# Altium schematic sheet CubeSat.SchDoc: CubeSat
size A4; Date: 19/10/2025; DrawnBy: Maymoun Jabnouni; SheetNumber: 1; SheetTotal: 3; SPICEModelCacheKLYHITPL: <root> / <DocumentId>KLYHITPL</DocumentId> / <CacheFrame Number="0"> / <Model Name="cap" Kind="MDL"> / <Text>*Default semiconductor capacitor / .MODEL CAP C()</Text> / </Model> / </CacheFrame> / </root>
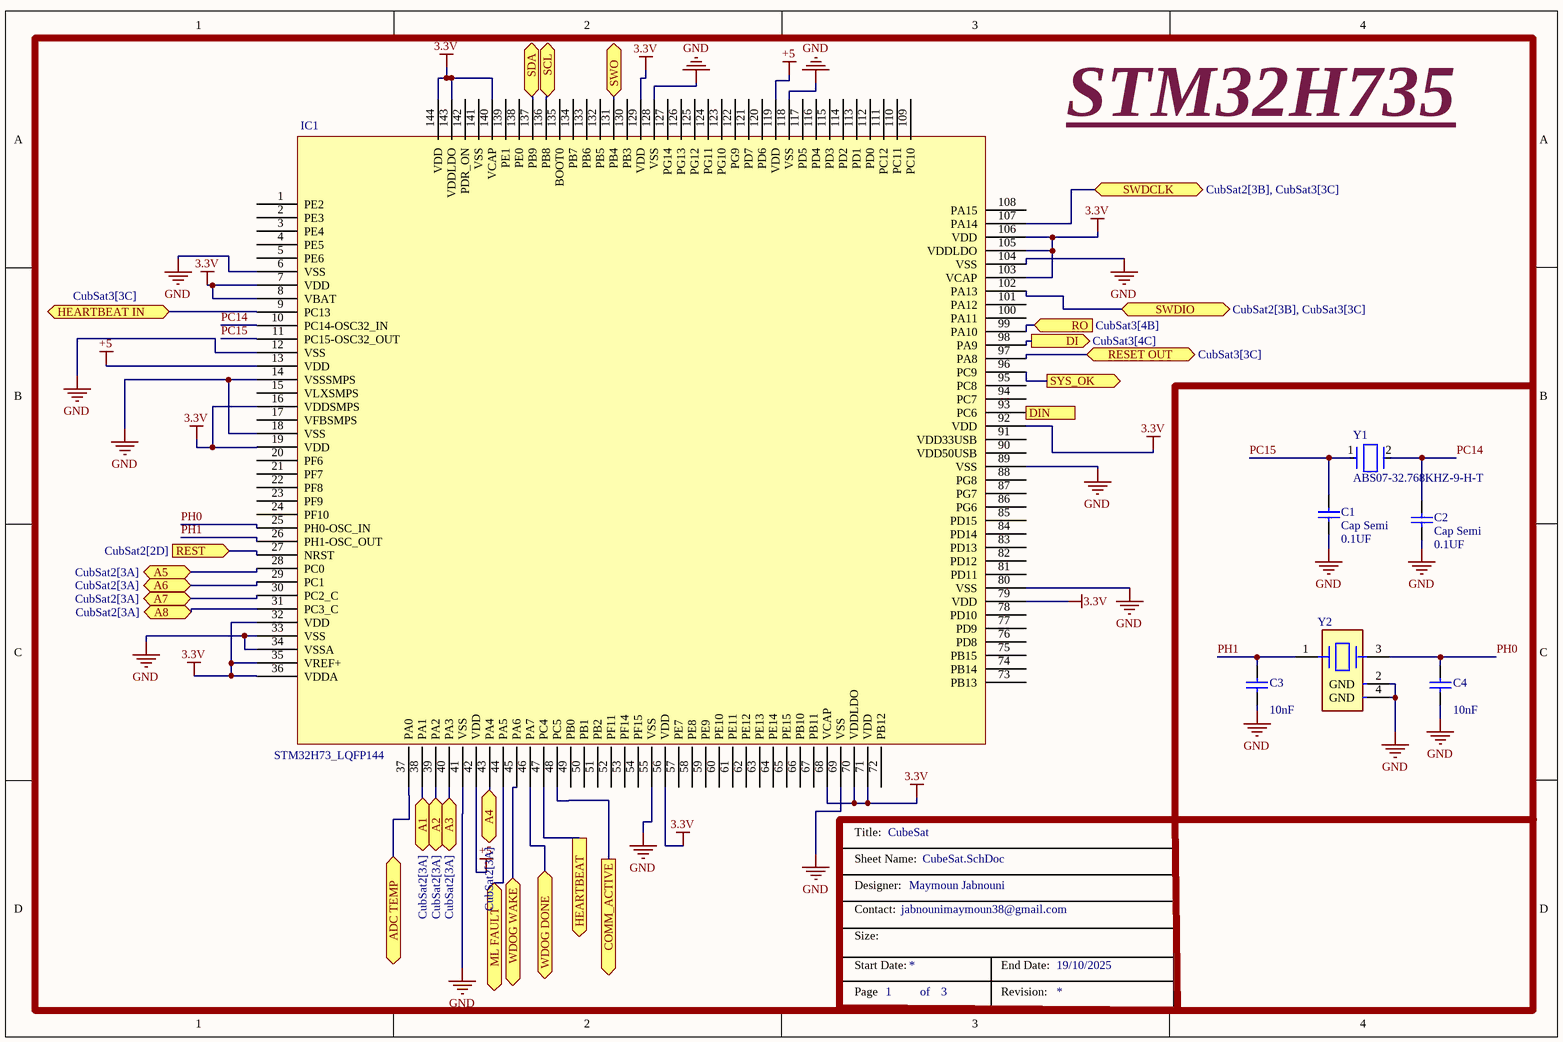
[diagram p0: CubeSat.SchDoc]

## Parts
C1  Cap Semi  value 0.1UF  [C1206]
C2  Cap Semi  value 0.1UF  [C1206]
C3  value 10nF  [C1206]  (hidden comment: Cap Semi)
C4  value 10nF  [C1206]  (hidden comment: Cap Semi)
IC1  STM32H73_LQFP144  [STM32H735LQFP144]
Y1  ABS07-32.768KHZ-9-H-T  [FP-ABS07-MFG]
Y2  ABM8W-19.0625MHZ-6-B1U-T3  [FP-ABM8W-MFG]  (value not drawn)

## Ports
A1 (bidir, see CubSat2[3A]), A2 (bidir, see CubSat2[3A]), A3 (bidir, see CubSat2[3A]), A4 (bidir, see CubSat2[3A]), A5 (bidir, see CubSat2[3A]), A6 (bidir, see CubSat2[3A]), A7 (bidir, see CubSat2[3A]), A8 (bidir, see CubSat2[3A]), ADC TEMP (bidir, see CubSat3[3C]), COMM_ACTIVE (out, see CubSat3[2A]), DI (out, see CubSat3[4C]), DIN (out, see CubSat3[1C]), HEARTBEAT (out, see CubSat3[1B]), HEARTBEAT IN (bidir, see CubSat3[3C]), ML FAULT (bidir, see CubSat3[3C]), RESET OUT (bidir, see CubSat3[3C]), REST (in, see CubSat2[2D]), RO (in, see CubSat3[4B]), SCL (bidir, see CubSat2[1B]), SDA (bidir, see CubSat2[1B]), SWDCLK (bidir, see CubSat2[3B], CubSat3[3C]), SWDIO (bidir, see CubSat2[3B], CubSat3[3C]), SWO (bidir, see CubSat2[3B]), SYS_OK (out, see CubSat3[1A]), WDOG DONE (bidir, see CubSat2[1D], CubSat3[3C]), WDOG WAKE (bidir, see CubSat2[2D], CubSat3[3C])

## Nets
3.3V: IC1.7(VDD) IC1.8(VBAT) IC1.16(VDDSMPS) IC1.19(VDD) IC1.32(VDD) IC1.35(VREF+) IC1.36(VDDA) IC1.56(VDD) IC1.68(VCAP) IC1.70(VDDLDO) IC1.71(VDD) IC1.79(VDD) IC1.92(VDD) IC1.103(VCAP) IC1.105(VDDLDO) IC1.106(VDD) IC1.129(VDD) IC1.140(VCAP) IC1.143(VDDLDO) IC1.144(VDD)
+5: IC1.13(VDD) IC1.42(VDD) IC1.119(VDD)
GND: C1.2 C2.2 C3.1 C4.1 IC1.6(VSS) IC1.12(VSS) IC1.14(VSSSMPS) IC1.18(VSS) IC1.33(VSS) IC1.34(VSSA) IC1.41(VSS) IC1.55(VSS) IC1.69(VSS) IC1.80(VSS) IC1.89(VSS) IC1.104(VSS) IC1.118(VSS) IC1.128(VSS) Y2.2(GND) Y2.4(GND)
A1: IC1.38(PA1) ; port A1
A2: IC1.39(PA2) ; port A2
A3: IC1.40(PA3) ; port A3
A4: IC1.43(PA4) ; port A4
A5: IC1.28(PC0) ; port A5
A6: IC1.29(PC1) ; port A6
A7: IC1.30(PC2_C) ; port A7
A8: IC1.31(PC3_C) ; port A8
ADC TEMP: IC1.37(PA0) ; port ADC TEMP
COMM_ACTIVE: IC1.48(PC5) ; port COMM_ACTIVE
DI: IC1.98(PA9) ; port DI
DIN: IC1.93(PC6) ; port DIN
HEARTBEAT: IC1.47(PC4) ; port HEARTBEAT
HEARTBEAT IN: IC1.9(PC13) ; port HEARTBEAT IN
ML FAULT: IC1.44(PA5) ; port ML FAULT
PC14: C2.1 IC1.10(PC14-OSC32_IN) Y1.2
PC15: C1.1 IC1.11(PC15-OSC32_OUT) Y1.1
PH0: C4.2 IC1.25(PH0-OSC_IN) Y2.3
PH1: C3.2 IC1.26(PH1-OSC_OUT) Y2.1
RESET OUT: IC1.97(PA8) ; port RESET OUT
REST: IC1.27(NRST) ; port REST
RO: IC1.99(PA10) ; port RO
SCL: IC1.136(PB8) ; port SCL
SDA: IC1.137(PB9) ; port SDA
SWDCLK: IC1.107(PA14) ; port SWDCLK
SWDIO: IC1.102(PA13) ; port SWDIO
SWO: IC1.131(PB4) ; port SWO
SYS_OK: IC1.96(PC9) ; port SYS_OK
WDOG DONE: IC1.46(PA7) ; port WDOG DONE
WDOG WAKE: IC1.45(PA6) ; port WDOG WAKE

Not connected (* = marked no-connect by the designer): IC1 1(PE2) 2(PE3) 3(PE4) 4(PE5) 5(PE6) 15(VLXSMPS) 17(VFBSMPS) 20(PF6) 21(PF7) 22(PF8) 23(PF9) 24(PF10) 49(PB0) 50(PB1) 51(PB2) 52(PF11) 53(PF14) 54(PF15) 57(PE7) 58(PE8) 59(PE9) 60(PE10) 61(PE11) 62(PE12) 63(PE13) 64(PE14) 65(PE15) 66(PB10) 67(PB11) 72(PB12) 73(PB13) 74(PB14) 75(PB15) 76(PD8) 77(PD9) 78(PD10) 81(PD11) 82(PD12) 83(PD13) 84(PD14) 85(PD15) 86(PG6) 87(PG7) 88(PG8) 90(VDD50USB) 91(VDD33USB) 94(PC7) 95(PC8) 100(PA11) 101(PA12) 108(PA15) 109(PC10) 110(PC11) 111(PC12) 112(PD0) 113(PD1) 114(PD2) 115(PD3) 116(PD4) 117(PD5) 120(PD6) 121(PD7) 122(PG9) 123(PG10) 124(PG11) 125(PG12) 126(PG13) 127(PG14) 130(PB3) 132(PB5) 133(PB6) 134(PB7) 135(BOOT0) 138(PE0) 139(PE1) 141(VSS) 142(PDR_ON)

## Notes on the sheet
- STM32H735
- Title:
- Sheet Name:
- Designer:
- Contact:
- jabnounimaymoun38@gmail.com
- Size:
- Start Date:
- Page
- of
- End Date:
- Revision:

## Library data of the parts
C1-C4 = Cap Semi: Capacitor (Semiconductor SIM Model); Published: 8-Jun-2000; LatestRevisionDate: 29-May-2009; LatestRevisionNote: IPC-7351 Footprint Added.; PackageReference: C1206; Publisher: Altium Limited; PackageDescription: Chip Capacitor
IC1 = IC_STM32H7: The STM32H735 is a high-performance 32-bit ARM® Cortex®-M7 microcontroller developed by STMicroelectronics. / It belongs to the STM32H7 family, which is designed for applications requiring very high processing power, fast data handling, and advanced control features.; Core: ARM® Cortex®-M7 32-bit CPU running up to 550 MHz; Flash Memory: 1 MB on-chip Flash; RAM: 564 KB total SRAM (including TCM and AXI SRAM); Operating Voltage: 1.62 V to 3.6 V; Clock System: Internal and external oscillators, with PLL for high-speed operation; Floating Point Unit (FPU): Single-precision FPU and DSP instructions; Security: Hardware cryptographic acceleration (AES, SHA, RSA, PKA), true RNG; DMA: Up to 16-stream DMA controller for fast peripheral data transfer; Timers: Up to 22 timers, including advanced PWM, encoder, and motor control timers; Communication Interfaces: - 3× I²C; ADC / DAC: - 3× 16-bit ADC (up to 3.6 MSPS); Package: LQFP144 — 144-pin Low-Profile Quad Flat Package
Y1 = CMP-27762-015610-1: Crystal 32.768kHz ±20ppm (Tol) 9pF FUND 70kΩ 2-Pin CSMD T/R; RoHS Compliant: Yes
Y2 = CMP-27762-014503-3: Crystal 19.0625MHz ±10ppm (Tol) ±10ppm (Stability) 6pF FUND 70Ω 4-Pin SMD T/R; ESR (Equivalent Series Resistance): 70R; Series: ABM8W; Frequency: 19.0625MHz; Min Operating Temperature: -20°C; Frequency Tolerance: 10ppm; Mount: Surface Mount; Max Operating Temperature: 70°C; Frequency Stability: 10ppm; Case/Package: SMD/SMT; Load Capacitance: 6pF